# Altium project Powerbank-PCB.PrjPcb (part 2 of 3)

## Sheet Power_PD.SchDoc
size A4; DrawnBy: UGUR KELES; SheetNumber: 3; SheetTotal: 4; Size: A4
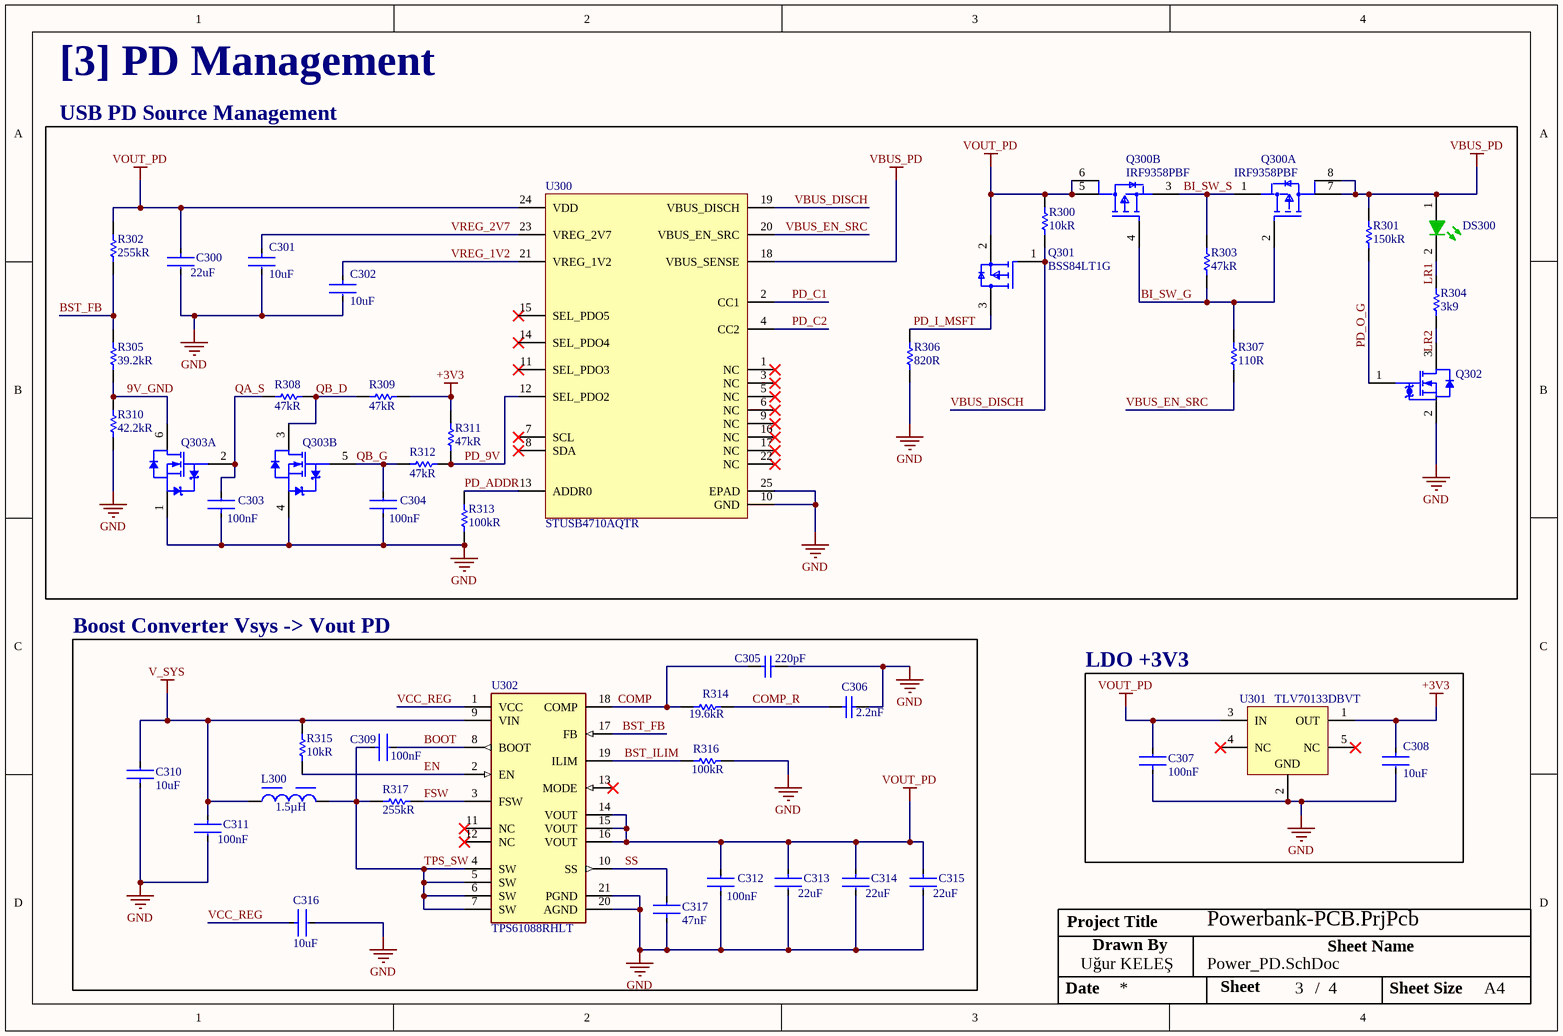
[diagram p2: Power_PD.SchDoc]

### Parts
C300  Capacitance: 22uF  [FP-GRT21B-0_2-IPC_C]  (hidden comment: GRT21BR61E226ME13L)
C301  Capacitance: 10uF  [FP-GRM188-0_2-MFG]  (hidden comment: GRM188R61E106MA73D)
C302  Capacitance: 10uF  [FP-GRM188-0_2-MFG]  (hidden comment: GRM188R61E106MA73D)
C303  Capacitance: 100nF  [FP-GRM155-0_05-IPC_A]  (hidden comment: GRM155R61H104KE19D)
C304  Capacitance: 100nF  [FP-GRM155-0_05-IPC_A]  (hidden comment: GRM155R61H104KE19D)
C305  value 220pF  [CAPC1005X55X25LL05T10]  (hidden comment: GRM155R71H221KA01D)
C306  value 2.2nF  [CAPC1005X55X25LL05T10]  (hidden comment: GRM155R71E222KA01D)
C307  Capacitance: 100nF  [FP-GRM155-0_05-IPC_A]  (hidden comment: GRM155R61H104KE19D)
C308  Capacitance: 10uF  [FP-GRM188-0_2-MFG]  (hidden comment: GRM188R61E106MA73D)
C309  Capacitance: 100nF  [FP-GRM155-0_05-IPC_A]  (hidden comment: GRM155R61H104KE19D)
C310  Capacitance: 10uF  [FP-GRM188-0_2-MFG]  (hidden comment: GRM188R61E106MA73D)
C311  Capacitance: 100nF  [FP-GRM155-0_05-IPC_A]  (hidden comment: GRM155R61H104KE19D)
C312  Capacitance: 100nF  [FP-GRM155-0_05-IPC_A]  (hidden comment: GRM155R61H104KE19D)
C313  Capacitance: 22uF  [FP-GRT21B-0_2-IPC_C]  (hidden comment: GRT21BR61E226ME13L)
C314  Capacitance: 22uF  [FP-GRT21B-0_2-IPC_C]  (hidden comment: GRT21BR61E226ME13L)
C315  Capacitance: 22uF  [FP-GRT21B-0_2-IPC_C]  (hidden comment: GRT21BR61E226ME13L)
C316  Capacitance: 10uF  [FP-GRM188-0_2-MFG]  (hidden comment: GRM188R61E106MA73D)
C317  Capacitance: 47nF  [FP-GRM155-0_05-MFG]  (hidden comment: GRM155R71E473KA88D)
DS300  KP-1608MGC  [KING-0603LED_GREEN_V]  (value not drawn)
L300  Inductance: 1.5µH  [WE-HCI_7040]  (hidden comment: 744311150)
Q300  IRF9358PBF  [FP-PG-DSO-8-MFG]  (parts A,B of 2)
Q301  BSS84LT1G  [FP-318-08-IPC_A]
Q302  2N7002KT3G  [ONSC-SOT-23-3-318-08_V]  (value not drawn)
Q303  2N7002BKS,115  [NXP-SOT363_M]  (value not drawn)  (parts A,B of 2)
R300  value 10kR  [RESC1005X40X25ML05T10]  (hidden comment: CRCW040210K0FKEDHP)
R301  value 150kR  [RESC1609X50X30ML10T20]  (hidden comment: CRCW0603150KFKTA)
R302  value 255kR  [RESC1005X40X25ML05T05]  (hidden comment: CRCW0402255KFKED)
R303  value 47kR  [RESC1005X40X25ML05T10]  (hidden comment: CRCW040247K0FKEDHP)
R304  value 3k9  [RESC0603(1608)_N]  (hidden comment: 3K9 5% 0603(1608))
R305  value 39.2kR  [RESC1005X40X25NL05T05]  (hidden comment: CRCW040239K2FKED)
R306  value 820R  [RESC0603(1608)_M]  (hidden comment: 820R 1% 0603(1608))
R307  value 110R  [RESC1005X40X25NL05T05]  (hidden comment: CRCW0402110RFKTD)
R308  value 47kR  [RESC1005X40X25ML05T10]  (hidden comment: CRCW040247K0FKEDHP)
R309  value 47kR  [RESC1005X40X25ML05T10]  (hidden comment: CRCW040247K0FKEDHP)
R310  value 42.2kR  [RESC1005X40X25ML05T05]  (hidden comment: CRCW040242K2FKED)
R311  value 47kR  [RESC1005X40X25ML05T10]  (hidden comment: CRCW040247K0FKEDHP)
R312  value 47kR  [RESC1005X40X25ML05T10]  (hidden comment: CRCW040247K0FKEDHP)
R313  value 100kR  [RESC1609X50X30ML10T20]  (hidden comment: CRCW0603100KFKEB)
R314  value 19.6kR  [RESC1005X40X25NL05T05]  (hidden comment: CRCW040219K6FKED)
R315  value 10kR  [RESC1005X40X25ML05T10]  (hidden comment: CRCW040210K0FKEDHP)
R316  value 100kR  [RESC1609X50X30ML10T20]  (hidden comment: CRCW0603100KFKEB)
R317  value 255kR  [RESC1005X40X25ML05T05]  (hidden comment: CRCW0402255KFKED)
U300  STUSB4710AQTR  [QFN24EP_4X4_STM]
U301  TLV70133DBVT  [DBV0005A_M]
U302  TPS61088RHLT  [FP-RHL0020A-MFG]

### Blocks framed on the sheet
USB PD Source Management: C300-C304 DS300 Q300-Q303 R300-R313 U300
Boost Converter Vsys -> Vout PD: C305 C306 C309-C317 L300 R314-R317 U302
LDO +3V3: C307 C308 U301

### Nets
+3V3: C308.1 R309.1 R311.2 U301.1(OUT)
GND: C300.2 C301.2 C302.2 C303.1 C304.1 C305.2 C306.2 C307.1 C308.2 C310.1 C311.2 C312.1 C313.2 C314.2 C315.2 C316.2 C317.1 Q302.2(S) Q303.1(S1) Q303.4(S2) R306.1 R310.1 R313.1 R316.2 U300.10(GND) U300.25(EPAD) U301.2(GND) U302.20(AGND) U302.21(PGND)
V_SYS: C310.2 C311.1 L300.1 R315.1 U302.9(VIN)
VBUS_PD: DS300.1(A) Q300.7(D2) Q300.8(D2) R301.1 U300.18(VBUS_SENSE)
VOUT_PD: C300.1 C307.2 C312.2 C313.1 C314.1 C315.1 Q300.5(D1) Q300.6(D1) Q301.2(S) R300.1 R302.2 U300.24(VDD) U301.3(IN) U302.14(VOUT) U302.15(VOUT) U302.16(VOUT)
9V_GND: Q303.6(D1) R305.1 R310.2
BI_SW_G: Q300.2(G2) Q300.4(G1) R303.1 R307.2
BI_SW_S: Q300.1(S2) Q300.3(S1) R303.2
BOOT: C309.2 U302.8(BOOT)
BST_FB: R302.1 R305.2 U302.17(FB)
BST_ILIM: R316.1 U302.19(ILIM)
COMP: C305.1 R314.1 U302.18(COMP)
COMP_R: C306.1 R314.2
EN: R315.2 U302.2(EN)
FSW: R317.2 U302.3(FSW)
LR1: DS300.2(K) R304.2
LR2: Q302.3(D) R304.1
PD_9V: R311.1 R312.1 U300.12(SEL_PDO2)
PD_ADDR: R313.2 U300.13(ADDR0)
PD_C1: U300.2(CC1)
PD_C2: U300.4(CC2)
PD_I_MSFT: Q301.3(D) R306.2
PD_O_G: Q302.1(G) R301.2
QA_S: C303.2 Q303.2(G1) R308.2
QB_D: Q303.3(D2) R308.1 R309.2
QB_G: C304.2 Q303.5(G2) R312.2
SS: C317.2 U302.10(SS)
TPS_SW: C309.1 L300.2 R317.1 U302.4(SW) U302.5(SW) U302.6(SW) U302.7(SW)
VBUS_DISCH: Q301.1(G) R300.2 U300.19(VBUS_DISCH)
VBUS_EN_SRC: R307.1 U300.20(VBUS_EN_SRC)
VCC_REG: C316.1 U302.1(VCC)
VREG_1V2: C302.1 U300.21(VREG_1V2)
VREG_2V7: C301.1 U300.23(VREG_2V7)

Not connected (* = marked no-connect by the designer): U300 1(NC)* 3(NC)* 5(NC)* 6(NC)* 7(SCL)* 8(SDA)* 9(NC)* 11(SEL_PDO3)* 14(SEL_PDO4)* 15(SEL_PDO5)* 16(NC)* 17(NC)* 22(NC)*; U301 4(NC)* 5(NC)*; U302 11(NC)* 12(NC)* 13(MODE)*

### Notes on the sheet
- [3] PD Management
- Project Title
- Uğur KELEŞ
- Drawn By
- Sheet Name
- Date
- Sheet
- /
- Sheet Size

### Library data of the parts
C300 C313-C315 = CMP-06035-011672-1: Multi-Layer Ceramic Capacitor 22uF 25V X5R ±20% 0805 Emboss T/R; Mount: Surface Mount; Case/Package: 0805; Min Operating Temperature: -55°C; Thickness: 0.057inch; Max Operating Temperature: 85°C; Case Code (Imperial): 0805; Voltage Rating: 25V; Length: 0.079inch; Ratings: AEC-Q200; Case Code (Metric): 2012; Width: 0.049inch; Packaging: Tape and Reel; Tolerance: 20%
C301 C302 C308 C310 C316 = CMP-2006-02520-2: Chip Multilayer Ceramic Capacitors for General Purpose, 0603, 10uF, X5R, 15%, 20%, 25V; Tolerance: 20%; Resistor Type: Ceramic; Voltage: 25V; Max Operating Temperature: 85°C; Min Operating Temperature: -55°C; Dielectric: X5R; Lead Free: Lead Free; REACH SVHC: No SVHC; Case/Package: 0603; Mount: Surface Mount; Voltage Rating (DC): 25V; Height: 0.8mm; Length: 1.6mm; Thickness: 0.031inch; Width: 0.031inch; Termination: SMD/SMT; Case Code (Imperial): 0603; Case Code (Metric): 1608; Package Quantity: 1; Packaging: Tape and Reel; Depth: 0.8mm; Voltage Rating: 25V; Weight: 0.000222oz; Number of Pins: 2
C303 C304 C307 C309 C311 C312 = CMP-2008-04108-2: Chip Multilayer Ceramic Capacitors for General Purpose, 0402, 0.10uF, X5R, 15%, 10%, 50V; Case/Package: 0402; Voltage: 50V; Dielectric: X5R; Height: 0.5mm; Case Code (Metric): 1005; Length: 1mm; Width: 0.02inch; Mount: Surface Mount; Case Code (Imperial): 0402; Lead Free: Lead Free; Depth: 0.5mm; Max Operating Temperature: 85°C; Tolerance: 10%; Voltage Rating (DC): 50V; Packaging: Tape and Reel; REACH SVHC: No SVHC; Voltage Rating: 50V; Min Operating Temperature: -55°C; Thickness: 0.022inch
C305 = CMP-2008-04649-1: Manufacturer: Murata; Dielectric Material: Ceramic; Multilayer: Yes; Tolerance  (fill in as +-): 10%; Rated DC Voltage (URdc): 50V; Temperature Characteristics Code: X7R; Part Number: GRM155R71H221KA01D; Supplier: Mouser; Supplier Part Number: 81-GRM155R71H221KA01; Manufacturer Part Number: GRM155R71H221KA01D; RoHS: Yes; Category: Ceramic Capacitors; Stock: 11836; Pricing: 1=0,1, 10=0,025, 50=0,025, 100=0,015, 1000=0,01, 10000=0,006 (USD); Mounting Technology: Surface Mount; Pins: 2; Package Shape: Rectangular; Case/Package: 0402; Terminal Finish: Nickel; Min Operating Temperature: -55°C; Max Operating Temperature: 125°C; JESD-609 Code: e3; Capacitor Type: Ceramic; Package Style: SMTMeter; Packaging: Tape and Reel; Tolerance (fill in as +-): 10%; Termination: Wraparound; Length: 1mm; Width: 0.5mm; Height: 0.5mm; Reach SVHC Compliant: Yes; RoHS Compliant: Yes; ComponentLink1URL: https://datasheet.ciiva.com:443/pdfs/VipMasterIC/IC/MURE/MURE-S-A0008911298/MURE-S-A0008911317-1.pdf?src-supplier=IHS+Markit; ComponentLink1Description: https://datasheet.ciiva.com:443/pdfs/VipMasterIC/IC/MURE/MURE-S-A0008911298/MURE-S-A0008911317-1.pdf?src-supplier=IHS+Markit; ComponentLink2URL: https://datasheet.ciiva.com/19476/1856450-19476323.pdf?src-supplier=Jameco; ComponentLink2Description: https://datasheet.ciiva.com/19476/1856450-19476323.pdf?src-supplier=Jameco; ComponentLink3URL: https://datasheet.ciiva.com/18101/getdatasheetpartid-37830-18101059.pdf?src-supplier=Verical; ComponentLink3Description: https://datasheet.ciiva.com/18101/getdatasheetpartid-37830-18101059.pdf?src-supplier=Verical; ComponentLink4URL: https://datasheet.ciiva.com/29199/454266-da-01-en-vs-kondensator-0402-29199758.pdf?src-supplier=Conrad; ComponentLink4Description: https://datasheet.ciiva.com/29199/454266-da-01-en-vs-kondensator-0402-29199758.pdf?src-supplier=Conrad; ComponentLink5URL: https://datasheet.ciiva.com/22698/608985-22698422.pdf?src-supplier=Element14; ComponentLink5Description: https://datasheet.ciiva.com/22698/608985-22698422.pdf?src-supplier=Element14; ComponentLink6URL: https://datasheet.ciiva.com/11605/product-11605114.pdf?src-supplier=Avnet; ComponentLink6Description: https://datasheet.ciiva.com/11605/product-11605114.pdf?src-supplier=Avnet; ComponentLink7URL: https://datasheet.ciiva.com/7937/608985-7937627.pdf?src-supplier=Element14; ComponentLink7Description: https://datasheet.ciiva.com/7937/608985-7937627.pdf?src-supplier=Element14; ComponentLink8URL: https://datasheet.ciiva.com/129/partnumbering-e-01-129859.pdf?src-supplier=Digikey; ComponentLink8Description: https://datasheet.ciiva.com/129/partnumbering-e-01-129859.pdf?src-supplier=Digikey; ComponentLink9URL: https://datasheet.ciiva.com/129/partnumbering-e-01-129858.pdf?src-supplier=Digikey; ComponentLink9Description: https://datasheet.ciiva.com/129/partnumbering-e-01-129858.pdf?src-supplier=Digikey; ComponentLink10URL: https://datasheet.ciiva.com/129/partnumbering-e-01-129860.pdf?src-supplier=Digikey; ComponentLink10Description: https://datasheet.ciiva.com/129/partnumbering-e-01-129860.pdf?src-supplier=Digikey; ComponentLink11URL: https://datasheet.ciiva.com/2989/product-2989405.pdf?src-supplier=Avnet; ComponentLink11Description: https://datasheet.ciiva.com/2989/product-2989405.pdf?src-supplier=Avnet
C306 = CMP-2008-03926-1: Manufacturer: Murata; Dielectric Material: Ceramic; Multilayer: Yes; Tolerance  (fill in as +-): 10%; Rated DC Voltage (URdc): 25V; Temperature Characteristics Code: X7R; Part Number: GRM155R71E222KA01D; Supplier: Mouser; Supplier Part Number: 81-GRM155R71E222KA1D; Manufacturer Part Number: GRM155R71E222KA01D; RoHS: Yes; Category: Ceramic Capacitors; Stock: 99453; Pricing: 1=0,1, 10=0,019, 50=0,019, 100=0,012, 1000=0,008, 10000=0,004 (USD); Mounting Technology: Surface Mount; Pins: 2; Package Shape: Rectangular; Case/Package: 0402; Terminal Finish: Nickel; Min Operating Temperature: -55°C; Max Operating Temperature: 125°C; JESD-609 Code: e3; Capacitor Type: Ceramic; Package Style: SMTMeter; Packaging: Tape and Reel; Tolerance (fill in as +-): 10%; Termination: Wraparound; Length: 1mm; Width: 0.5mm; Height: 0.5mm; Reach SVHC Compliant: Yes; RoHS Compliant: Yes; ComponentLink1URL: https://datasheet.ciiva.com:443/pdfs/VipMasterIC/IC/MURE/MURE-S-A0004362469/MURE-S-A0004364458-1.pdf?src-supplier=IHS+Markit; ComponentLink1Description: https://datasheet.ciiva.com:443/pdfs/VipMasterIC/IC/MURE/MURE-S-A0004362469/MURE-S-A0004364458-1.pdf?src-supplier=IHS+Markit; ComponentLink2URL: https://datasheet.ciiva.com/18184/getdatasheetpartid-476555-18184699.pdf?src-supplier=Verical; ComponentLink2Description: https://datasheet.ciiva.com/18184/getdatasheetpartid-476555-18184699.pdf?src-supplier=Verical; ComponentLink3URL: https://datasheet.ciiva.com/129/partnumbering-e-01-129988.pdf?src-supplier=Digikey; ComponentLink3Description: https://datasheet.ciiva.com/129/partnumbering-e-01-129988.pdf?src-supplier=Digikey; ComponentLink4URL: https://datasheet.ciiva.com/129/partnumbering-e-01-129987.pdf?src-supplier=Digikey; ComponentLink4Description: https://datasheet.ciiva.com/129/partnumbering-e-01-129987.pdf?src-supplier=Digikey; ComponentLink5URL: https://datasheet.ciiva.com/129/partnumbering-e-01-129989.pdf?src-supplier=Digikey; ComponentLink5Description: https://datasheet.ciiva.com/129/partnumbering-e-01-129989.pdf?src-supplier=Digikey; ComponentLink6URL: https://datasheet.ciiva.com/16396/product-16396812.pdf?src-supplier=Future+Electronics; ComponentLink6Description: https://datasheet.ciiva.com/16396/product-16396812.pdf?src-supplier=Future+Electronics
C317 = CMP-2008-04630-5: Chip Multilayer Ceramic Capacitors for General Purpose, 0402, 47000pF, X7R, 15%, 10%, 25V; Depth: 0.5mm; Case/Package: 0402; Tolerance: 10%; REACH SVHC: No SVHC; Termination: SMD/SMT; Number of Pins: 2; Mount: Surface Mount; Radiation Hardening: No; Height: 0.5mm; Min Operating Temperature: -55°C; Max Operating Temperature: 125°C; Thickness: 0.022inch; Length: 1mm; Voltage Rating (DC): 25V; Material: Ceramic; Lead Free: Lead Free; Packaging: Tape and Reel; Dielectric: X7R; Voltage: 25V; Case Code (Metric): 1005; Width: 0.02inch; Case Code (Imperial): 0402; Voltage Rating: 25V; Package Quantity: 1
DS300 = CMP-0404-00001-1: LED, SMT, 0603(1608), 1.1mm thickness, Green; Manufacturer: Kingbright; Reverse Voltage: 5 V; Power Dissipation: 75 mW; Forward Current: 30 mA; Packing Type: 2000 pcs / reel; Mounting Technology: Surface Mount; Storage Temperature: -40 to +85 degC; ComponentLink1URL: http://www.kingbright.com/; PackageDescription: 2-Pin SMT LED, 1.6 x 0.8 mm Pitch; PartNumber: KP-1608MGC; PackageReference: 0603LED_GREEN; ComponentLink1Description: Manufacturer URL
L300 = CMP-0226-00074-2: NexarPartId: 7864308; Tolerance: 20%; Max DC Current: 11A; Shielding: Shielded; DC Resistance (DCR): 6.6mΩ; Saturation Current: 14A; Series Resistance: 6.6Ω; Test Frequency: 100kHz; Self Resonant Frequency: 72MHz; Military Standard: Not; Length: 7mm; REACH SVHC: Unknown; Composition: Wirewound; Width: 6.9mm; Max Operating Temperature: 150°C; Height: 3.8mm; Packaging: Cut Tape (CT); Lead Free: Lead Free; Termination: SMD/SMT; Inductance Tolerance: 20%; Mount: Surface Mount; Ambient Temperature Range Low: -40°C; Ambient Temperature Range High: 100°C; RoHS: Compliant; Current Rating: 11A; Number of Pins: 2; Resistance: 6.6mΩ; Case/Package: Nonstandard; Height - Seated (Max): 3.9878mm; Min Operating Temperature: -40°C; Depth: 7.2mm; RMS Current (Irms): 11A
Q300 = CMP-32901-000089-1: MOSFET 2P-CH 30V 9.2A 8SOIC; Manufacturer: Infineon Technologies; Continuous Drain Current: -9.2A; Reverse Recovery Charge: 35nC; Gate Charge At Vgs: 19nC @ -4.5V; Max Forward Diode Voltage: -1.2V; Threshold Vgs Max: -2.4V; Turn Off Delay Time: 146ns; Threshold Vgs Min: -1.3V; Standoff Height: 0.1mm; Depletion Mode: False; Drain To Source Voltage: -30V; Gate To Source Voltage: 20V; Input Capacitace At Vds: 1740pF @ -25V; Power Dissipation: 2W; Number Of P Channels: 2; Transconductance: 23S; Rthja Max: 62.5°C/W; Reverse Recovery Time: 55ns; Max Junction Temp: +150°C; Pulse Drain Current: -73A; Drain To Source Resistance: 19mΩ; Turn On Delay Time: 5.7ns; Mouser Description: Dual P-Channel 30 V 16.3 mOhm 19 nC HEXFET® Power Mosfet - SOIC-8; Footprint Url: https://www.infineon.com/dgdl/po-so8.pdf?fileId=5546d462580663ef0158068a1275014d; Temperature: -55°C to +150°C; Height: 1.75mm; Manufacturer Part Number: IRF9358PBF; Device Class L2: Transistors; ComponentLink2Description: Datasheet; ComponentLink2URL: https://www.infineon.com/dgdl/irf9358pbf.pdf?fileId=5546d462533600a4015356114ffa1da5; Ipc Land Pattern Name: SOIC127P600X155-8; Drain To Source Breakdown Voltage: -30V; Device Class L1: Discrete Semiconductors; Number Of Channels: 2; Automotive: No; Temperature Range High: +150°C; Temperature Range Low: -55°C; Device Class L3: MOSFETs; Octopart: https://octopart.com/irf9358pbf-infineon-65873752; Lead Free: Yes; Package: PG-DSO-8; Category: Trans; RoHS: TRUE; Digikey Description: MOSFET 2P-CH 30V 9.2A 8SOIC
Q301 = CMP-1058-00762-2: MOSFET P-CH 50V 130MA SOT-23; Max Power Dissipation: 225mW; On-State Resistance: 10R; Nominal Vgs: 2V; Gate to Source Voltage (Vgs): 20V; Rise Time: 1ns; Turn-Off Delay Time: 16ns; Voltage Rating (DC): -50V; Turn-On Delay Time: 3.6ns; Number of Elements: 1; Current Rating: -130mA; Input Capacitance: 30pF; Threshold Voltage: -2V; Element Configuration: Single; Drain to Source Breakdown Voltage: 50V; Continuous Drain Current (ID): 130mA; Length: 0.119inch; Drain to Source Voltage (Vdss): 50V; Min Operating Temperature: -55°C; Contact Plating: Tin; Lead Free: Lead Free; Width: 0.055inch; Case/Package: SOT-23-3; Max Operating Temperature: 150°C; Halogen Free: Halogen Free; Radiation Hardening: No; Drain to Source Resistance: 10R; REACH SVHC: No SVHC; Power Dissipation: 225mW; Number of Pins: 3; Package Quantity: 1; Packaging: Tape and Reel; Fall Time: 1ns; Rds On Max: 10R; Height: 0.04inch
Q302 = CMP-1058-00785-1: Small Signal MOSFET, 60 V, 380 mA, Single, N-Channel, 3-Pin SOT-23, Pb-Free, Tape and Reel; Manufacturer: On Semiconductor; Crss Typ (pF): 2.2; Ciss Typ (pF): 24.5; VGS Max (V): 20; ID Max (A): 0.38; VGS(th) Max (V): 2.3; Channel Polarity: N Channel; Coss Typ (pF): 4.2; V(BR)DSS Min (V): 60; Package Type: SOT-23-3; Mounting Technology: Surface Mount; ComponentLink2URL: http://www.onsemi.com/pub_link/Collateral/2N7002K-D.PDF; ComponentLink3Description: Package Specification; DatasheetVersion: Rev. 11; Configuration: Single; PackageReference: SOT-23-3-318-08; Packing: Tape and Reel; ComponentLink2Description: Datasheet; PackageVersion: Rev. AP, 11/2009; RoHS: Pb-Free; ComponentLink1Description: Manufacturer URL; ComponentLink1URL: http://www.onsemi.com/; PackageDescription: 3-Pin Small Outline Transistor, Body 2.92 x 1.3 mm, Pitch 0.95 mm; PartNumber: 2N7002KT3G; ComponentLink3URL: http://www.onsemi.cn/pub_link/Collateral/318-08.PDF
Q303 = CMP-1259-00110-1: Dual N-Channel Trench MOSFET, 60 V, 0.3 A, -55 to 150 degC, 6-Pin SOT363, Tape and Reel; Manufacturer: NXP Semiconductors; VDS [max] (V): 60; VGSth [typ] (V): 1.6; Channel Type: N; ID [max] (A): 0.3; Automotive Qualified: Y; IDM [max] (A): 1.2; Packing: Tape & Reel; PackageDescription: 6-Pin Small Outline Transistor Package, Body 2 x 1.25 mm, Pitch 0.65 mm; Code_JEITA: SC-88; ComponentLink2URL: http://www.nxp.com/documents/data_sheet/2N7002BKS.pdf; ComponentLink1URL: http://www.nxp.com/; DatasheetVersion: Rev. 2; PartNumber: 2N7002BKS,115; ComponentLink1Description: Manufacturer URL; PackageVersion: 06-03-16, 03/2006; PackageReference: SOT363; ComponentLink3Description: Package Specification; ComponentLink3URL: http://www.nxp.com/documents/outline_drawing/sot363_po.pdf; Mounting Technology: Surface Mount; ComponentLink2Description: Datasheet
R300 R315 = CMP-2002-03043-1: Manufacturer: Vishay Dale; Tolerance: 1%; Power: 200mW; Working Voltage: 50V; Temperature Coefficient (ppm/Cel): 100; Rated Temperature: 70°C; Package Height: 0.3mm; Package Length: 1mm; Package Width: 0.5mm; Reference Standard: AEC-Q200; Part Number: CRCW040210K0FKEDHP; Supplier: Mouser; Supplier Part Number: 71-CRCW040210K0FKEDH; Manufacturer Part Number: CRCW040210K0FKEDHP; RoHS: Yes; Category: Chip SMD Resistors; Stock: 170765; Pricing: 1=0,11, 10=0,035, 50=0,035, 100=0,02, 1000=0,016, 10000=0,012 (USD); Mounting Technology: Surface Mount; Pins: 2; Case/Package: 0402; Terminal Finish: Nickel; Package Shape: Rectangular; Min Operating Temperature: -55°C; Max Operating Temperature: 155°C; JESD-609 Code: e3; Resistor Type: FIXED RESISTOR; Construction: Chip; Packaging: Tape and Reel; Technology: METAL GLAZE/THICK FILM; Termination: Wraparound; Reach SVHC Compliant: Yes; RoHS Compliant: Yes; ComponentLink1URL: https://datasheet.ciiva.com:443/pdfs/VipMasterIC/IC/VISH/VISH-S-A0009391795/VISH-S-A0009391795-1.pdf?src-supplier=IHS+Markit; ComponentLink1Description: https://datasheet.ciiva.com:443/pdfs/VipMasterIC/IC/VISH/VISH-S-A0009391795/VISH-S-A0009391795-1.pdf?src-supplier=IHS+Markit; ComponentLink2URL: https://datasheet.ciiva.com/7725/crcwhpe3-7725759.pdf?src-supplier=Element14; ComponentLink2Description: https://datasheet.ciiva.com/7725/crcwhpe3-7725759.pdf?src-supplier=Element14; ComponentLink3URL: https://datasheet.ciiva.com/28588/1750852-28588877.pdf?src-supplier=Element14; ComponentLink3Description: https://datasheet.ciiva.com/28588/1750852-28588877.pdf?src-supplier=Element14; ComponentLink4URL: https://datasheet.ciiva.com/5550/crcwhpe3-46056-5550367.pdf?src-supplier=Mouser; ComponentLink4Description: https://datasheet.ciiva.com/5550/crcwhpe3-46056-5550367.pdf?src-supplier=Mouser; ComponentLink5URL: https://datasheet.ciiva.com/9052/crcwhpe3-9052616.pdf?src-supplier=Avnet; ComponentLink5Description: https://datasheet.ciiva.com/9052/crcwhpe3-9052616.pdf?src-supplier=Avnet
R301 = CMP-2000-03911-1: Manufacturer: Vishay Dale; Tolerance: 1%; Power: 100mW; Rated Temperature: 70°C; Working Voltage: 75V; Temperature Coefficient (ppm/Cel): 100; Package Height: 0.45mm; Package Length: 1.55mm; Package Width: 0.85mm; Reference Standard: AEC-Q200; Part Number: CRCW0603150KFKTA; Supplier: Mouser; Supplier Part Number: 71-CRCW0603-150K; Manufacturer Part Number: CRCW0603150KFKTA; RoHS: No; Category: Chip SMD Resistors; Stock: 12269; Pricing: 1=0,2, 10=0,129, 50=0,129, 100=0,05, 1000=0,022, 10000=0,016 (USD); Mounting Technology: Surface Mount; Pins: 2; Package Shape: Rectangular; Case/Package: 0603; Terminal Finish: Nickel; Min Operating Temperature: -55°C; Max Operating Temperature: 155°C; JESD-609 Code: e0; Resistor Type: FIXED RESISTOR; Construction: Chip; Packaging: Tape and Reel; Technology: METAL GLAZE/THICK FILM; Termination: Wraparound; RoHS Compliant: No; Reach SVHC Compliant: No; ComponentLink1URL: https://datasheet.ciiva.com:443/pdfs/VipMasterIC/IC/VISH/VISH-S-A0002183699/VISH-S-A0002183699-1.pdf?src-supplier=IHS+Markit; ComponentLink1Description: https://datasheet.ciiva.com:443/pdfs/VipMasterIC/IC/VISH/VISH-S-A0002183699/VISH-S-A0002183699-1.pdf?src-supplier=IHS+Markit; ComponentLink2URL: https://datasheet.ciiva.com/2564/dcrcw-2564967.pdf?src-supplier=Digikey; ComponentLink2Description: https://datasheet.ciiva.com/2564/dcrcw-2564967.pdf?src-supplier=Digikey
R302 R317 = CMP-2002-08414-1: Manufacturer: Vishay Dale; Tolerance: 1%; Power: 63mW; Rated Temperature: 70°C; Working Voltage: 50V; Temperature Coefficient (ppm/Cel): 100; Package Height: 0.35mm; Package Length: 1mm; Package Width: 0.5mm; Reference Standard: AEC-Q200; Part Number: CRCW0402255KFKED; Supplier: Mouser; Supplier Part Number: 71-CRCW0402-255K-E3; Manufacturer Part Number: CRCW0402255KFKED; RoHS: Yes; Category: Chip SMD Resistors; Stock: 37899; Pricing: 1=0,1, 10=0,017, 50=0,017, 100=0,01, 1000=0,008, 10000=0,004 (USD); Mounting Technology: Surface Mount; Pins: 2; Package Shape: Rectangular; Case/Package: 0402; Terminal Finish: Nickel; Min Operating Temperature: -55°C; Max Operating Temperature: 155°C; JESD-609 Code: e3; Resistor Type: FIXED RESISTOR; Construction: Chip; Packaging: Tape and Reel; Technology: METAL GLAZE/THICK FILM; Termination: Wraparound; Reach SVHC Compliant: Yes; RoHS Compliant: Yes; ComponentLink1URL: https://datasheet.ciiva.com:443/pdfs/VipMasterIC/IC/VISH/VISH-S-A0007266705/VISH-S-A0007266705-1.pdf?src-supplier=IHS+Markit; ComponentLink1Description: https://datasheet.ciiva.com:443/pdfs/VipMasterIC/IC/VISH/VISH-S-A0007266705/VISH-S-A0007266705-1.pdf?src-supplier=IHS+Markit; ComponentLink2URL: https://datasheet.ciiva.com/7743/125364-7743535.pdf?src-supplier=Element14; ComponentLink2Description: https://datasheet.ciiva.com/7743/125364-7743535.pdf?src-supplier=Element14; ComponentLink3URL: https://datasheet.ciiva.com/2464/dcrcwe3-2464586.pdf?src-supplier=Digikey; ComponentLink3Description: https://datasheet.ciiva.com/2464/dcrcwe3-2464586.pdf?src-supplier=Digikey; ComponentLink4URL: https://datasheet.ciiva.com/2464/dcrcwe3-2464587.pdf?src-supplier=Digikey; ComponentLink4Description: https://datasheet.ciiva.com/2464/dcrcwe3-2464587.pdf?src-supplier=Digikey; ComponentLink5URL: https://datasheet.ciiva.com/2464/dcrcwe3-2464585.pdf?src-supplier=Digikey; ComponentLink5Description: https://datasheet.ciiva.com/2464/dcrcwe3-2464585.pdf?src-supplier=Digikey; ComponentLink6URL: https://datasheet.ciiva.com/16760/70201119-16760447.pdf?src-supplier=Allied+Electronics; ComponentLink6Description: https://datasheet.ciiva.com/16760/70201119-16760447.pdf?src-supplier=Allied+Electronics; ComponentLink7URL: https://datasheet.ciiva.com/7673/1697337-7673999.pdf?src-supplier=Element14; ComponentLink7Description: https://datasheet.ciiva.com/7673/1697337-7673999.pdf?src-supplier=Element14; ComponentLink8URL: https://datasheet.ciiva.com/22708/1697337-22708044.pdf?src-supplier=Element14; ComponentLink8Description: https://datasheet.ciiva.com/22708/1697337-22708044.pdf?src-supplier=Element14; ComponentLink9URL: https://datasheet.ciiva.com/5545/dcrcwe3-109170-5545531.pdf?src-supplier=Mouser; ComponentLink9Description: https://datasheet.ciiva.com/5545/dcrcwe3-109170-5545531.pdf?src-supplier=Mouser; ComponentLink10URL: https://datasheet.ciiva.com/3256/dcrcwe3-3256285.pdf?src-supplier=Avnet; ComponentLink10Description: https://datasheet.ciiva.com/3256/dcrcwe3-3256285.pdf?src-supplier=Avnet
R303 R308 R309 R311 R312 = CMP-2002-03053-1: Manufacturer: Vishay Dale; Manufacturer Series: CRCW-HPE3; Tolerance: 1%; Power: 200mW; Rated Temperature: 70°C; Working Voltage: 50V; Temperature Coefficient (ppm/Cel): 100; Package Height: 0.3mm; Package Length: 1mm; Package Width: 0.5mm; Reference Standard: AEC-Q200; Part Number: CRCW040247K0FKEDHP; Supplier: Mouser; Supplier Part Number: 71-CRCW040247K0FKEDH; Manufacturer Part Number: CRCW040247K0FKEDHP; RoHS: Yes; Category: Chip SMD Resistors; Stock: 32197; Pricing: 1=0,13, 10=0,06, 50=0,06, 100=0,034, 1000=0,021, 10000=0,013 (USD); Mounting Technology: Surface Mount; Pins: 2; Package Shape: Rectangular; Case/Package: 0402; Terminal Finish: Nickel; Min Operating Temperature: -55°C; Max Operating Temperature: 155°C; JESD-609 Code: e3; Resistor Type: FIXED RESISTOR; Construction: Chip; Packaging: Tape and Reel; Technology: METAL GLAZE/THICK FILM; Termination: Wraparound; Series: CRCW-HP E3; Reach SVHC Compliant: Yes; RoHS Compliant: Yes; ComponentLink1URL: https://datasheet.ciiva.com:443/pdfs/VipMasterIC/IC/VISH/VISH-S-A0009391795/VISH-S-A0009391795-1.pdf?src-supplier=IHS+Markit; ComponentLink1Description: https://datasheet.ciiva.com:443/pdfs/VipMasterIC/IC/VISH/VISH-S-A0009391795/VISH-S-A0009391795-1.pdf?src-supplier=IHS+Markit; ComponentLink2URL: https://datasheet.ciiva.com/5542/crcwhpe3-46056-5542331.pdf?src-supplier=Mouser; ComponentLink2Description: https://datasheet.ciiva.com/5542/crcwhpe3-46056-5542331.pdf?src-supplier=Mouser; ComponentLink3URL: https://datasheet.ciiva.com/9006/crcwhpe3-9006518.pdf?src-supplier=Avnet; ComponentLink3Description: https://datasheet.ciiva.com/9006/crcwhpe3-9006518.pdf?src-supplier=Avnet
R304 = CMP-1012-00088-1: 3K9 0.1W 5% 0603 (1608 Metric)  SMD; Case-EIA: 0603; Case-Metric: 1608; Power: 0.1 W; Technology: SMT; Tolerance: 5 %
R305 = CMP-2002-08571-1: Manufacturer: Vishay Dale; Tolerance: 1%; Power: 63mW; Rated Temperature: 70°C; Working Voltage: 50V; Temperature Coefficient (ppm/Cel): 100; Package Height: 0.35mm; Package Length: 1mm; Package Width: 0.5mm; Reference Standard: AEC-Q200; Part Number: CRCW040239K2FKED; Supplier: Mouser; Supplier Part Number: 71-CRCW0402-39.2K-E3; Manufacturer Part Number: CRCW040239K2FKED; RoHS: Yes; Category: Chip SMD Resistors; Stock: 28886; Pricing: 1=0,1, 10=0,017, 50=0,017, 100=0,01, 1000=0,008, 10000=0,004 (USD); Mounting Technology: Surface Mount; Pins: 2; Package Shape: Rectangular; Case/Package: 0402; Terminal Finish: Nickel; Min Operating Temperature: -55°C; Max Operating Temperature: 155°C; JESD-609 Code: e3; Resistor Type: FIXED RESISTOR; Construction: Chip; Packaging: Tape and Reel; Technology: METAL GLAZE/THICK FILM; Termination: Wraparound; Reach SVHC Compliant: Yes; RoHS Compliant: Yes; ComponentLink1URL: https://datasheet.ciiva.com:443/pdfs/VipMasterIC/IC/VISH/VISH-S-A0007266705/VISH-S-A0007266705-1.pdf?src-supplier=IHS+Markit; ComponentLink1Description: https://datasheet.ciiva.com:443/pdfs/VipMasterIC/IC/VISH/VISH-S-A0007266705/VISH-S-A0007266705-1.pdf?src-supplier=IHS+Markit
R306 = CMP-1012-00839-1: 820R 0.1W 1% 0603 (1608 Metric)  SMD; Case-Metric: 1608; Case-EIA: 0603; Tolerance: 1 %; Power: 0.1 W; Technology: SMT
R307 = CMP-2002-00387-1: Manufacturer: Vishay Dale; Tolerance: 1%; Power: 63mW; Rated Temperature: 70°C; Working Voltage: 50V; Temperature Coefficient (ppm/Cel): 100; Package Height: 0.35mm; Package Length: 1mm; Package Width: 0.5mm; Reference Standard: AEC-Q200; Part Number: CRCW0402110RFKTD; Supplier: Mouser; Supplier Part Number: 71-CRCW0402-110; Manufacturer Part Number: CRCW0402110RFKTD; RoHS: No; Category: Chip SMD Resistors; Stock: 28266; Pricing: 1=0,15, 10=0,076, 50=0,076, 100=0,043, 1000=0,027, 10000=0,023 (USD); Mounting Technology: Surface Mount; Pins: 2; Package Shape: Rectangular; Case/Package: 0402; Terminal Finish: Nickel; Min Operating Temperature: -55°C; Max Operating Temperature: 155°C; JESD-609 Code: e0; Resistor Type: FIXED RESISTOR; Construction: Chip; Packaging: Tape and Reel; Technology: METAL GLAZE/THICK FILM; Termination: Wraparound; RoHS Compliant: No; Reach SVHC Compliant: No; ComponentLink1URL: https://datasheet.ciiva.com:443/pdfs/VipMasterIC/IC/VISH/VISH-S-A0002183699/VISH-S-A0002183699-1.pdf?src-supplier=IHS+Markit; ComponentLink1Description: https://datasheet.ciiva.com:443/pdfs/VipMasterIC/IC/VISH/VISH-S-A0002183699/VISH-S-A0002183699-1.pdf?src-supplier=IHS+Markit; ComponentLink2URL: https://datasheet.ciiva.com/2563/dcrcw-2563028.pdf?src-supplier=Digikey; ComponentLink2Description: https://datasheet.ciiva.com/2563/dcrcw-2563028.pdf?src-supplier=Digikey; ComponentLink3URL: https://datasheet.ciiva.com/8977/dcrcw-8977478.pdf?src-supplier=Avnet; ComponentLink3Description: https://datasheet.ciiva.com/8977/dcrcw-8977478.pdf?src-supplier=Avnet
R310 = CMP-2002-08626-1: Manufacturer: Vishay Dale; Tolerance: 1%; Power: 63mW; Rated Temperature: 70°C; Working Voltage: 50V; Temperature Coefficient (ppm/Cel): 100; Package Height: 0.35mm; Package Length: 1mm; Package Width: 0.5mm; Reference Standard: AEC-Q200; Part Number: CRCW040242K2FKED; Supplier: Mouser; Supplier Part Number: 71-CRCW0402-42.2K-E3; Manufacturer Part Number: CRCW040242K2FKED; RoHS: Yes; Category: Chip SMD Resistors; Stock: 64442; Pricing: 1=0,1, 10=0,017, 50=0,017, 100=0,01, 1000=0,008, 10000=0,004 (USD); Mounting Technology: Surface Mount; Pins: 2; Package Shape: Rectangular; Case/Package: 0402; Terminal Finish: Nickel; Min Operating Temperature: -55°C; Max Operating Temperature: 155°C; JESD-609 Code: e3; Resistor Type: FIXED RESISTOR; Construction: Chip; Packaging: Tape and Reel; Technology: METAL GLAZE/THICK FILM; Termination: Wraparound; Reach SVHC Compliant: Yes; RoHS Compliant: Yes; ComponentLink1URL: https://datasheet.ciiva.com:443/pdfs/VipMasterIC/IC/VISH/VISH-S-A0007266705/VISH-S-A0007266705-1.pdf?src-supplier=IHS+Markit; ComponentLink1Description: https://datasheet.ciiva.com:443/pdfs/VipMasterIC/IC/VISH/VISH-S-A0007266705/VISH-S-A0007266705-1.pdf?src-supplier=IHS+Markit; ComponentLink2URL: https://datasheet.ciiva.com/3882/41397335s9853079n6892-3882805.pdf?src-supplier=Arrow+Electronics; ComponentLink2Description: https://datasheet.ciiva.com/3882/41397335s9853079n6892-3882805.pdf?src-supplier=Arrow+Electronics; ComponentLink3URL: https://datasheet.ciiva.com/11818/0900766b80d98824-11818095.pdf?src-supplier=Rs; ComponentLink3Description: https://datasheet.ciiva.com/11818/0900766b80d98824-11818095.pdf?src-supplier=Rs; ComponentLink4URL: https://datasheet.ciiva.com/7743/125364-7743643.pdf?src-supplier=Element14; ComponentLink4Description: https://datasheet.ciiva.com/7743/125364-7743643.pdf?src-supplier=Element14; ComponentLink5URL: https://datasheet.ciiva.com/2494/dcrcwe3-2494977.pdf?src-supplier=Digikey; ComponentLink5Description: https://datasheet.ciiva.com/2494/dcrcwe3-2494977.pdf?src-supplier=Digikey; ComponentLink6URL: https://datasheet.ciiva.com/2494/dcrcwe3-2494976.pdf?src-supplier=Digikey; ComponentLink6Description: https://datasheet.ciiva.com/2494/dcrcwe3-2494976.pdf?src-supplier=Digikey; ComponentLink7URL: https://datasheet.ciiva.com/2494/dcrcwe3-2494975.pdf?src-supplier=Digikey; ComponentLink7Description: https://datasheet.ciiva.com/2494/dcrcwe3-2494975.pdf?src-supplier=Digikey; ComponentLink8URL: https://datasheet.ciiva.com/16763/70201119-16763237.pdf?src-supplier=Allied+Electronics; ComponentLink8Description: https://datasheet.ciiva.com/16763/70201119-16763237.pdf?src-supplier=Allied+Electronics; ComponentLink9URL: https://datasheet.ciiva.com/3256/dcrcwe3-3256517.pdf?src-supplier=Avnet; ComponentLink9Description: https://datasheet.ciiva.com/3256/dcrcwe3-3256517.pdf?src-supplier=Avnet; ComponentLink10URL: https://datasheet.ciiva.com/8336/dcrcwe3-8336730.pdf?src-supplier=Avnet; ComponentLink10Description: https://datasheet.ciiva.com/8336/dcrcwe3-8336730.pdf?src-supplier=Avnet; ComponentLink11URL: https://datasheet.ciiva.com/7671/1697337-7671599.pdf?src-supplier=Element14; ComponentLink11Description: https://datasheet.ciiva.com/7671/1697337-7671599.pdf?src-supplier=Element14; ComponentLink12URL: https://datasheet.ciiva.com/22702/1697337-22702879.pdf?src-supplier=Element14; ComponentLink12Description: https://datasheet.ciiva.com/22702/1697337-22702879.pdf?src-supplier=Element14
R313 R316 = CMP-2000-03821-1: Manufacturer: Vishay Dale; Tolerance: 1%; Power: 100mW; Working Voltage: 75V; Temperature Coefficient (ppm/Cel): 100; Rated Temperature: 70°C; Package Height: 0.45mm; Package Length: 1.55mm; Package Width: 0.85mm; Reference Standard: AEC-Q200; Part Number: CRCW0603100KFKEB; Supplier: Mouser; Supplier Part Number: 71-CRCW0603100KFKEB; Manufacturer Part Number: CRCW0603100KFKEB; RoHS: Yes; Category: Chip SMD Resistors; Stock: 18081; Pricing: 1=0,1, 10=0,017, 50=0,017, 100=0,01, 1000=0,008, 10000=0,007 (USD); Mounting Technology: Surface Mount; Pins: 2; Case/Package: 0603; Terminal Finish: Nickel; Package Shape: Rectangular; Min Operating Temperature: -55°C; Max Operating Temperature: 155°C; JESD-609 Code: e3; Resistor Type: FIXED RESISTOR; Construction: Chip; Packaging: Tape and Reel; Technology: METAL GLAZE/THICK FILM; Termination: Wraparound; Reach SVHC Compliant: Yes; RoHS Compliant: Yes; ComponentLink1URL: https://datasheet.ciiva.com:443/pdfs/VipMasterIC/IC/VISH/VISH-S-A0007266705/VISH-S-A0007266705-1.pdf?src-supplier=IHS+Markit; ComponentLink1Description: https://datasheet.ciiva.com:443/pdfs/VipMasterIC/IC/VISH/VISH-S-A0007266705/VISH-S-A0007266705-1.pdf?src-supplier=IHS+Markit; ComponentLink2URL: https://datasheet.ciiva.com/28621/1747939-28621366.pdf?src-supplier=Element14; ComponentLink2Description: https://datasheet.ciiva.com/28621/1747939-28621366.pdf?src-supplier=Element14; ComponentLink3URL: https://datasheet.ciiva.com/3256/dcrcwe3-3256919.pdf?src-supplier=Avnet; ComponentLink3Description: https://datasheet.ciiva.com/3256/dcrcwe3-3256919.pdf?src-supplier=Avnet
R314 = CMP-2002-08273-1: Manufacturer: Vishay Dale; Tolerance: 1%; Power: 63mW; Working Voltage: 50V; Temperature Coefficient (ppm/Cel): 100; Rated Temperature: 70°C; Package Height: 0.35mm; Package Length: 1mm; Package Width: 0.5mm; Reference Standard: AEC-Q200; Part Number: CRCW040219K6FKED; Supplier: Mouser; Supplier Part Number: 71-CRCW0402-19.6K-E3; Manufacturer Part Number: CRCW040219K6FKED; RoHS: Yes; Category: Chip SMD Resistors; Stock: 6968; Pricing: 1=0,1, 10=0,016, 50=0,016, 100=0,01, 1000=0,008, 10000=0,004 (USD); Mounting Technology: Surface Mount; Pins: 2; Case/Package: 0402; Terminal Finish: Nickel; Package Shape: Rectangular; Min Operating Temperature: -55°C; Max Operating Temperature: 155°C; JESD-609 Code: e3; Resistor Type: FIXED RESISTOR; Construction: Chip; Packaging: Tape and Reel; Technology: METAL GLAZE/THICK FILM; Termination: Wraparound; Reach SVHC Compliant: Yes; RoHS Compliant: Yes; ComponentLink1URL: https://datasheet.ciiva.com:443/pdfs/VipMasterIC/IC/VISH/VISH-S-A0007266705/VISH-S-A0007266705-1.pdf?src-supplier=IHS+Markit; ComponentLink1Description: https://datasheet.ciiva.com:443/pdfs/VipMasterIC/IC/VISH/VISH-S-A0007266705/VISH-S-A0007266705-1.pdf?src-supplier=IHS+Markit; ComponentLink2URL: https://datasheet.ciiva.com/2463/dcrcwe3-2463544.pdf?src-supplier=Digikey; ComponentLink2Description: https://datasheet.ciiva.com/2463/dcrcwe3-2463544.pdf?src-supplier=Digikey; ComponentLink3URL: https://datasheet.ciiva.com/2463/dcrcwe3-2463545.pdf?src-supplier=Digikey; ComponentLink3Description: https://datasheet.ciiva.com/2463/dcrcwe3-2463545.pdf?src-supplier=Digikey; ComponentLink4URL: https://datasheet.ciiva.com/2463/dcrcwe3-2463546.pdf?src-supplier=Digikey; ComponentLink4Description: https://datasheet.ciiva.com/2463/dcrcwe3-2463546.pdf?src-supplier=Digikey; ComponentLink5URL: https://datasheet.ciiva.com/3256/dcrcwe3-3256137.pdf?src-supplier=Avnet; ComponentLink5Description: https://datasheet.ciiva.com/3256/dcrcwe3-3256137.pdf?src-supplier=Avnet; ComponentLink6URL: https://datasheet.ciiva.com/5543/dcrcwe3-109170-5543245.pdf?src-supplier=Mouser; ComponentLink6Description: https://datasheet.ciiva.com/5543/dcrcwe3-109170-5543245.pdf?src-supplier=Mouser; ComponentLink7URL: https://datasheet.ciiva.com/16392/dcrcwe3-16392762.pdf?src-supplier=Future+Electronics; ComponentLink7Description: https://datasheet.ciiva.com/16392/dcrcwe3-16392762.pdf?src-supplier=Future+Electronics; ComponentLink8URL: https://datasheet.ciiva.com/16775/70201119-16775753.pdf?src-supplier=Allied+Electronics; ComponentLink8Description: https://datasheet.ciiva.com/16775/70201119-16775753.pdf?src-supplier=Allied+Electronics; ComponentLink9URL: https://datasheet.ciiva.com/7663/1697337-7663853.pdf?src-supplier=Element14; ComponentLink9Description: https://datasheet.ciiva.com/7663/1697337-7663853.pdf?src-supplier=Element14; ComponentLink10URL: https://datasheet.ciiva.com/7663/1697337-7663854.pdf?src-supplier=Element14; ComponentLink10Description: https://datasheet.ciiva.com/7663/1697337-7663854.pdf?src-supplier=Element14; ComponentLink11URL: https://datasheet.ciiva.com/22702/1697337-22702869.pdf?src-supplier=Element14; ComponentLink11Description: https://datasheet.ciiva.com/22702/1697337-22702869.pdf?src-supplier=Element14; ComponentLink12URL: https://datasheet.ciiva.com/22872/70201119-22872102.pdf?src-supplier=Allied+Electronics; ComponentLink12Description: https://datasheet.ciiva.com/22872/70201119-22872102.pdf?src-supplier=Allied+Electronics
U300 = STUSB4710AQTR: Power Supply Support Circuit, Adjustable, 2 Channel, 0.2; Manufacturer: STMicroelectronics; Supplier: Mouser; Supplier Part Number: 511-STUSB4710AQTR; Manufacturer Part Number: STUSB4710AQTR; RoHS: Yes; Category: Power Management ICs; Stock: 10482; Pricing: 1=2,74, 10=1,88, 50=1,88, 100=1,68, 1000=1,38, 10000=1,23 (USD); Throw Configuration: POWER SUPPLY SUPPORT CIRCUIT; Reach SVHC Compliant: Yes; RoHS Compliant: Yes; ComponentLink1URL: https://datasheet.ciiva.com:443/pdfs/VipMasterIC/IC/SGST/SGST-S-A0003683934/SGST-S-A0003683934-1.pdf?src-supplier=IHS+Markit; ComponentLink1Description: https://datasheet.ciiva.com:443/pdfs/VipMasterIC/IC/SGST/SGST-S-A0003683934/SGST-S-A0003683934-1.pdf?src-supplier=IHS+Markit; ComponentLink2URL: http://www.st.com/content/ccc/resource/technical/document/datasheet/group3/2f/24/4e/67/ed/d6/4b/af/DM00383615/files/DM00383615.pdf/jcr:content/translations/en.DM00383615.pdf?src-supplier=Digikey; ComponentLink2Description: http://www.st.com/content/ccc/resource/technical/document/datasheet/group3/2f/24/4e/67/ed/d6/4b/af/DM00383615/files/DM00383615.pdf/jcr:content/translations/en.DM00383615.pdf?src-supplier=Digikey
U301 = CMP-0394-00566-2: Single Output LDO, 150 mA, Fixed 3.3 V Output, 2.5 to 24 V Input, with Ultra-Low IQ, 5-pin SOT-23 (DBV), -40 to 85 degC, Green (RoHS & no Sb/Br); Manufacturer: Texas Instruments; Vout Adj(Min)(V): 3.3; Iq(Typ)(mA): 0.032; Vin(Min)(V): 2.5; Vin(Max)(V): 24; SubFamily: Single Channel LDO; Accuracy(%): 2; Vdo(Typ)(mV): 400; Iout(Max)(A): 0.15; Mounting Technology: Surface Mount; ComponentLink2URL: http://www.ti.com/general/docs/lit/getliterature.tsp?genericPartNumber=TLV70133&fileType=pdf; ComponentLink1URL: http://www.ti.com/; ComponentLink3URL: http://www.ti.com/litv/pdf/mpds018i; Eco-Plan: Green (RoHS & no Sb/Br); DatasheetVersion: SBVS161; PackageDescription: 5-Pin Plastic Small Outline, Body 1.60 Ãƒâ€” 2.90 mm, Pitch 0.95 mm; ComponentLink2Description: Datasheet; Fixed Output Options(V): 3.3; PartNumber: TLV70133DBVT; PackageReference: DBV0005A; Code_JEDEC: MO-178; PackageVersion: 4073253-4/K; Vout Adj(Max)(V): 3.3; ComponentLink1Description: Manufacturer URL; ComponentLink3Description: Package Specification
U302 = CMP-04918-000117-1: IC REG BOOST ADJ 10A 20VQFN; Manufacturer: Texas Instruments; Output Voltage: 4.5-12.6V; Max Junction Temp: +125°C; Max Duty Cycle: 90%; Output Type: AdjustableProgrammable; Nominal Supply Current: 1-110uA; Min Supply Voltage: 2.7V; Switching Frequency: 200-2200kHz; Number Of Outputs: 1; Max Supply Voltage: 12V; Manufacturer Part Number: TPS61088RHLT; Digikey Description: IC REG BOOST ADJ 10A 20VQFN; Octopart: https://octopart.com/tps61088rhlt-texas+instruments-57155059; Switching Topology: Boost; Lead Free: Yes; Output Current: 10A; Height: 1mm; Temperature: -40°C to +85°C; Package: RHL0020A; Device Class L3: Voltage Regulators - Switching; RoHS: TRUE; Temperature Range Low: -40°C; Temperature Range High: +85°C; Device Class L1: Integrated Circuits (ICs); Automotive: No; Category: IC; ComponentLink2Description: Datasheet; ComponentLink2URL: http://www.ti.com/lit/ds/symlink/tps61088.pdf; Device Class L2: Power Management ICs